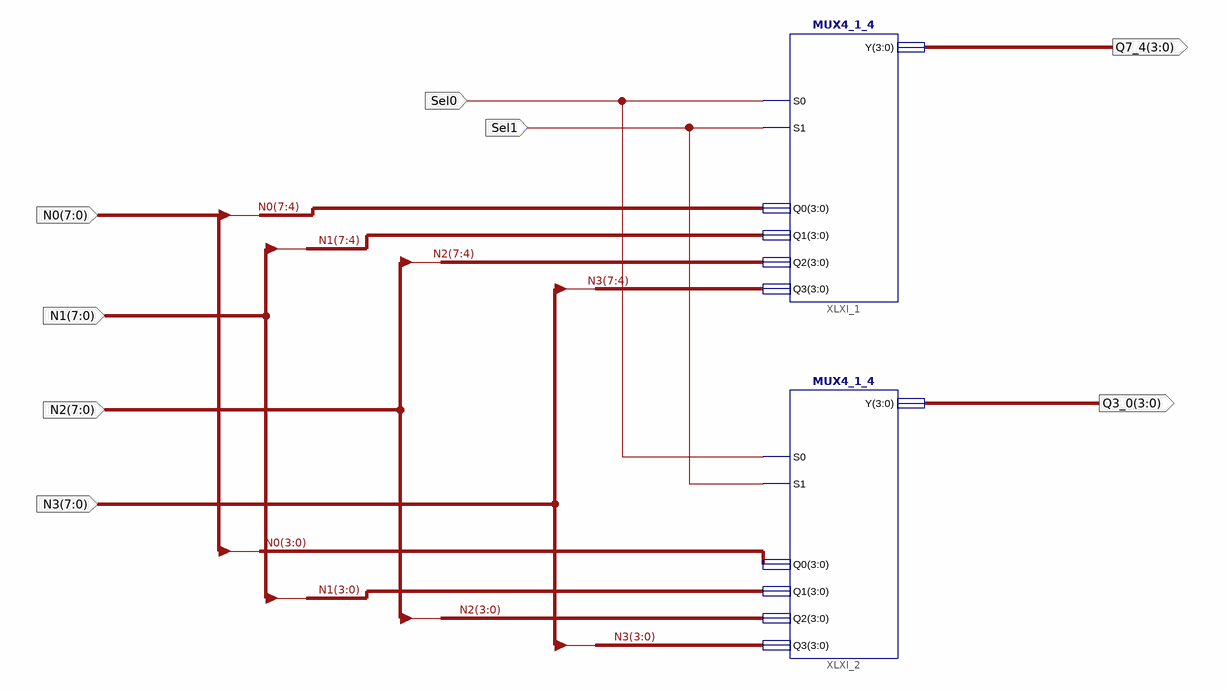
[diagram p0: schematic sheet 1]
// Xilinx ISE schematic MUX4_1_8.sch (spartan6) as structural Verilog: 2 symbols, 8 ports
module MUX4_1_8 (
  input  Sel0,
  input  Sel1,
  input  [7:0] N0,
  input  [7:0] N1,
  input  [7:0] N2,
  input  [7:0] N3,
  output [3:0] Q3_0,
  output [3:0] Q7_4
);

  MUX4_1_4 XLXI_1 (.Q0(N0[7:4]), .Q1(N1[7:4]), .S0(Sel0), .S1(Sel1), .Q2(N2[7:4]), .Q3(N3[7:4]), .Y(Q7_4));
  MUX4_1_4 XLXI_2 (.Q0(N0[3:0]), .Q1(N1[3:0]), .S0(Sel0), .S1(Sel1), .Q2(N2[3:0]), .Q3(N3[3:0]), .Y(Q3_0));
endmodule
